# Altium schematic sheet 5V_Isolated_Power_Supply_samples.SchDoc: RP2040 CNC
size B; Author: AM; CompanyName: Expatria Technologies; DrawnBy: A.Marles; Engineer: AM; Organization: Expatria Technolgoies; DocumentNumber: 9; SheetNumber: 9; SheetTotal: 13
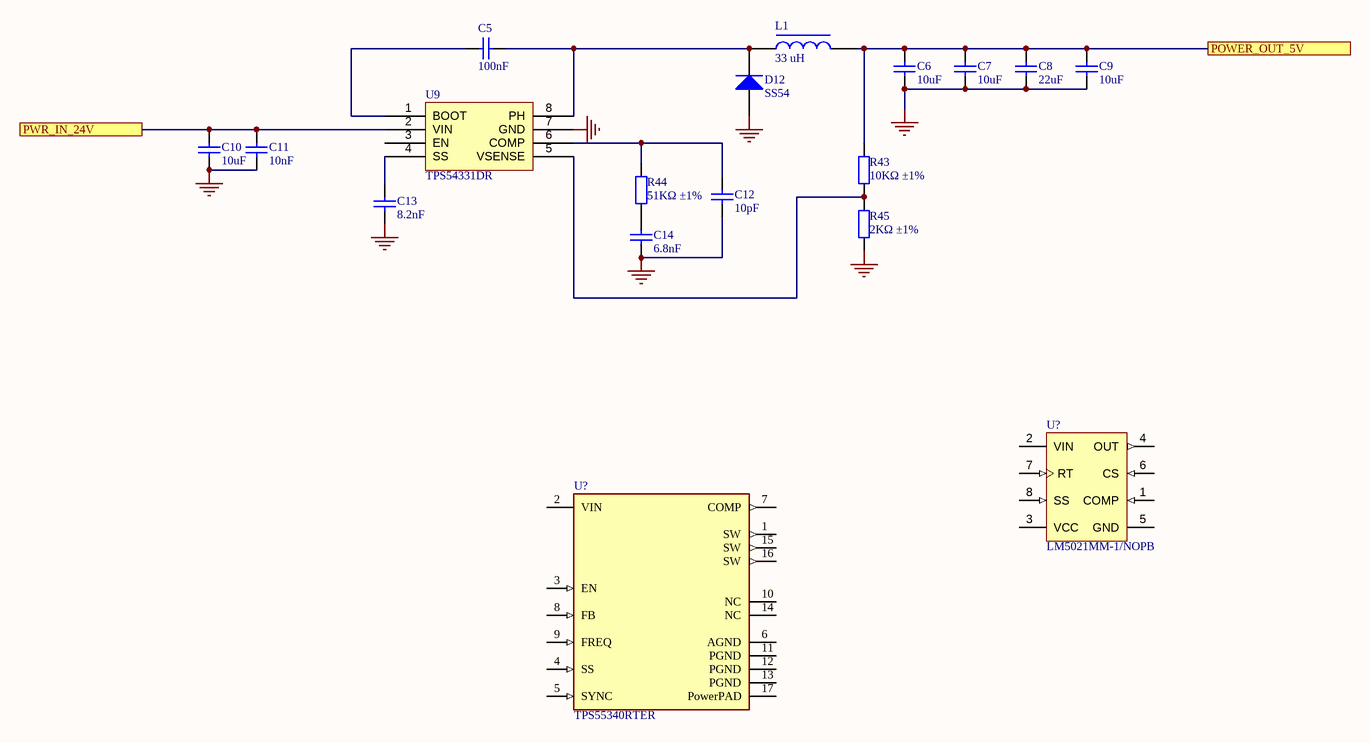
[diagram p0: 5V_Isolated_Power_Supply_samples.SchDoc]

## Parts
(Parts that share a designator on the sheet are numbered #1, #2 ... from top to bottom, then left to right.)
C5  100nF  [0603_C]
C6  10uF  [0603_C]
C7  10uF  [0603_C]
C8  22uF  [0805_C]
C9  10uF  [0603_C]
C10  10uF  [1206_C]
C11  10nF  [0402_C]
C12  10pF  [0402_C]
C13  8.2nF  [0603_C]
C14  6.8nF  [0402_C]
D12  SS54  [SMA(DO-214AC)_S1]
L1  33 uH  [INDPM7366X300N]
R43  10KΩ ±1%  [0402_R]
R44  51KΩ ±1%  [0402_R]
R45  2KΩ ±1%  [0402_R]
U9  TPS54331DR  [SOIC-8_150mil]
U?#1  LM5021MM-1/NOPB  [DGK0008A_L]
U?#2  TPS55340RTER  [FP-RTE0016C-IPC_A]

## Ports
POWER_OUT_5V, PWR_IN_24V

## Nets
GND: C6.1 C7.1 C8.1 C9.1 C10.1 C11.1 C12.1 C13.1 C14.1 D12.1(A) R45.1 U9.7(GND)
POWER_OUT_5V: C6.2 C7.2 C8.2 C9.2 L1.2 R43.2 ; port POWER_OUT_5V
PWR_IN_24V: C10.2 C11.2 U9.2(VIN) ; port PWR_IN_24V
NetC5_1: C5.1 U9.1(BOOT)
NetC5_2: C5.2 D12.2(K) L1.1 U9.8(PH)
NetC12_2: C12.2 R44.2 U9.6(COMP)
NetC13_2: C13.2 U9.4(SS)
NetC14_2: C14.2 R44.1
NetR43_1: R43.1 R45.2 U9.5(VSENSE)

Not connected (* = marked no-connect by the designer): U9 3(EN); U?#1 1(COMP) 2(VIN) 3(VCC) 4(OUT) 5(GND) 6(CS) 7(RT) 8(SS); U?#2 1(SW) 2(VIN) 3(EN) 4(SS) 5(SYNC) 6(AGND) 7(COMP) 8(FB) 9(FREQ) 10(NC) 11(PGND) 12(PGND) 13(PGND) 14(NC) 15(SW) 16(SW) 17(PowerPAD)

## Notes on the sheet
- SHEET
- Expatria Technologies
- 1136 Glade Court
- Port Coquitlam, BC V3B 1R5
- PROJECT
- SIZE
- ENGR
- MODIFIED
- DOCUMENT
- REV
- Copyright Expatria Technologies 2021.  This document describes Open Hardware and is licensed under the CERN-OHL-P  v2.  No warranty is implied or expressed.
- EMAIL: INFO@EXPATRIA.CA
- B
- /

## Library data of the parts
C5 = 0603 100nF (104) 10% 50V: Chip capacitors; Manufacturer: YAGEO; PartNumber: CC0603KRX7R9BB104; Tolerance: 10%; Voltage: 50V; ComponentLink1Description: Supplier link; ComponentLink1URL: http://www.szlcsc.com/product/details_15331.html; Package: 0603; Supplier: LC; SuppliersPartNumber: C14663; Capacitance: 100nF
C6 C7 C9 = 0603 10uF (106) 10% 10V: Chip capacitors; Manufacturer: Samsung Electro-Mechanics; PartNumber: CL10A106KP8NNNC; Tolerance: 10%; Voltage: 10V; ComponentLink1Description: Supplier link; ComponentLink1URL: http://www.szlcsc.com/product/details_20411.html; Package: 0603; Supplier: LC; SuppliersPartNumber: C19702; Capacitance: 10uF
C8 = 0805 22uF (226) 20% 25V: Chip capacitors; Manufacturer: Samsung Electro-Mechanics; PartNumber: CL21A226MAQNNNE; Tolerance: 20%; Voltage: 25V; ComponentLink1Description: Supplier link; ComponentLink1URL: http://www.szlcsc.com/product/details_46786.html; Package: 0805; Supplier: LC; SuppliersPartNumber: C45783; Capacitance: 22uF
C10 = 1206 10uF (106) 10% 50V: Chip capacitors; Manufacturer: Samsung Electro-Mechanics; PartNumber: CL31A106KBHNNNE; Tolerance: 10%; Voltage: 50V; ComponentLink1Description: Supplier link; ComponentLink1URL: http://www.szlcsc.com/product/details_14236.html; Package: 1206; Supplier: LC; SuppliersPartNumber: C13585; Capacitance: 10uF
C11 = 0402 10nF (103) 10% 50V: Chip capacitors; Manufacturer: Samsung Electro-Mechanics; PartNumber: CL05B103KB5NNNC; Tolerance: 10%; Voltage: 50V; ComponentLink1Description: Supplier link; ComponentLink1URL: http://www.szlcsc.com/product/details_15869.html; Package: 0402; Supplier: LC; SuppliersPartNumber: C15195; Capacitance: 10nF
C12 = 0402 10pF (100) 5% 50V: Chip capacitors; Manufacturer: Samsung Electro-Mechanics; PartNumber: CL05C100JB5NNNC; Tolerance: 5%; Voltage: 50V; ComponentLink1Description: Supplier link; ComponentLink1URL: http://www.szlcsc.com/product/details_33914.html; Package: 0402; Supplier: LC; SuppliersPartNumber: C32949; Capacitance: 10pF
C13 = 0603 8.2nF (822) 10% 50V: Chip capacitors; Manufacturer: Samsung Electro-Mechanics; PartNumber: CL10B822KB8NNNC; Tolerance: 10%; Voltage: 50V; ComponentLink1Description: Supplier link; ComponentLink1URL: http://www.szlcsc.com/product/details_28670.html; Package: 0603; Supplier: LC; SuppliersPartNumber: C27920; Capacitance: 8.2nF
C14 = 0402 6.8nF (682) 10% 50V: Chip capacitors; Manufacturer: Guangdong Fenghua Advanced Tech; PartNumber: 0402B682K500NT; Tolerance: 10%; Voltage: 50V; ComponentLink1Description: Supplier link; ComponentLink1URL: http://www.szlcsc.com/product/details_1894.html; Package: 0402; Supplier: LC; SuppliersPartNumber: C1542; Capacitance: 6.8nF
D12 = SMA(DO-214AC) SS54: 二极管; ComponentLink1Description: 供应商链接; ComponentLink1URL: http://www.szlcsc.com/product/details_23178.html; Package: SMA(DO-214AC); Supplier: LC; SuppliersPartNumber: C22452
L1 = 1206 10uH 10%: 33uH ±20% 2A 270mΩ SMD,6.6x7.3x3.0mm Power Inductors RoHS; ComponentLink1Description: 供应商链接; ComponentLink1URL: http://www.szlcsc.com/product/details_1403.html; Package: SMD_6.6x7.3x3.0mm; Supplier: JLCPCB; SuppliersPartNumber: C329385
R43 = 0402 10K (1002) 1%: Chip resistor; Manufacturer: Uniroyal Elec; PartNumber: 0402WGF1002TCE; Power: 1/16W; ComponentLink1Description: Supplier link; ComponentLink1URL: http://www.szlcsc.com/product/details_26487.html; Package: 0402; Supplier: LC; SuppliersPartNumber: C25744; Resistance: 10KΩ; Tolerance: 1%
R44 = 0402 51K (5102) 1%: Chip resistor; Manufacturer: Uniroyal Elec; PartNumber: 0402WGF5102TCE; Power: 1/16W; ComponentLink1Description: Supplier link; ComponentLink1URL: http://www.szlcsc.com/product/details_26537.html; Package: 0402; Supplier: LC; SuppliersPartNumber: C25794; Resistance: 51KΩ; Tolerance: 1%
R45 = 0402 2K (2001) 1%: Chip resistor; Manufacturer: Uniroyal Elec; PartNumber: 0402WGF2001TCE; Power: 1/16W; ComponentLink1Description: Supplier link; ComponentLink1URL: http://www.szlcsc.com/product/details_4516.html; Package: 0402; Supplier: LC; SuppliersPartNumber: C4109; Resistance: 2KΩ; Tolerance: 1%
U9 = TPS54331DR_[C9865]: DC-DC芯片; ComponentLink1Description: 供应商链接; ComponentLink1URL: http://www.szlcsc.com/product/details_10397.html; Package: SOIC-8_150mil; Supplier: LC; SuppliersPartNumber: C9865
U?#1 = CMP-0069-01357-3: AC-DC Current Mode PWM Controller, 8-pin MSOP, Pb-Free; Manufacturer: Texas Instruments; PackageTopMarking: ZXTT*21-1; CompType: Switcher; PowerWise: N; ComponentLink1Description: Datasheet URL; Code_JEDEC: MO-187-AA; ComponentLink1URL: http://www.ti.com/general/docs/lit/getliterature.tsp?genericPartNumber=LM5021&fileType=pdf; PinCount: 8; PackageReference: DGK0008A; RoHS: Y; PackageDescription: MINI SOIC, .118 x .118 x .034in, 8 Lead, .0256in Pitch; SuppliersPartNumber: C202233
U?#2 = CMP-04918-000344-1: IC REG BOOST ADJ 5.25A 16WQFN; Number of Outputs: 1; Max Output Current: 5A; Max Output Voltage: 38V; Quiescent Current: 500uA; Synchronous Rectifier: No; Output Type: Adjustable; Switching Frequency: 1.14MHz; Min Input Voltage: 2.9V; Max Input Voltage: 32V; Topology: Boost; Number of Pins: 16; RoHS Compliant: Yes; Package Quantity: 3000; REACH SVHC: No SVHC; Mount: Surface Mount; Max Operating Temperature: 150°C; Contact Plating: Gold; Output Voltage: 38V; Min Operating Temperature: -40°C; Output Current: 5A; Lead Free: Lead Free; Series: -; Min Output Voltage: 2.9V; Packaging: Tape and Reel; SuppliersPartNumber: C169167